# Altium project Shining Pig.PrjPCB (part 3 of 3)
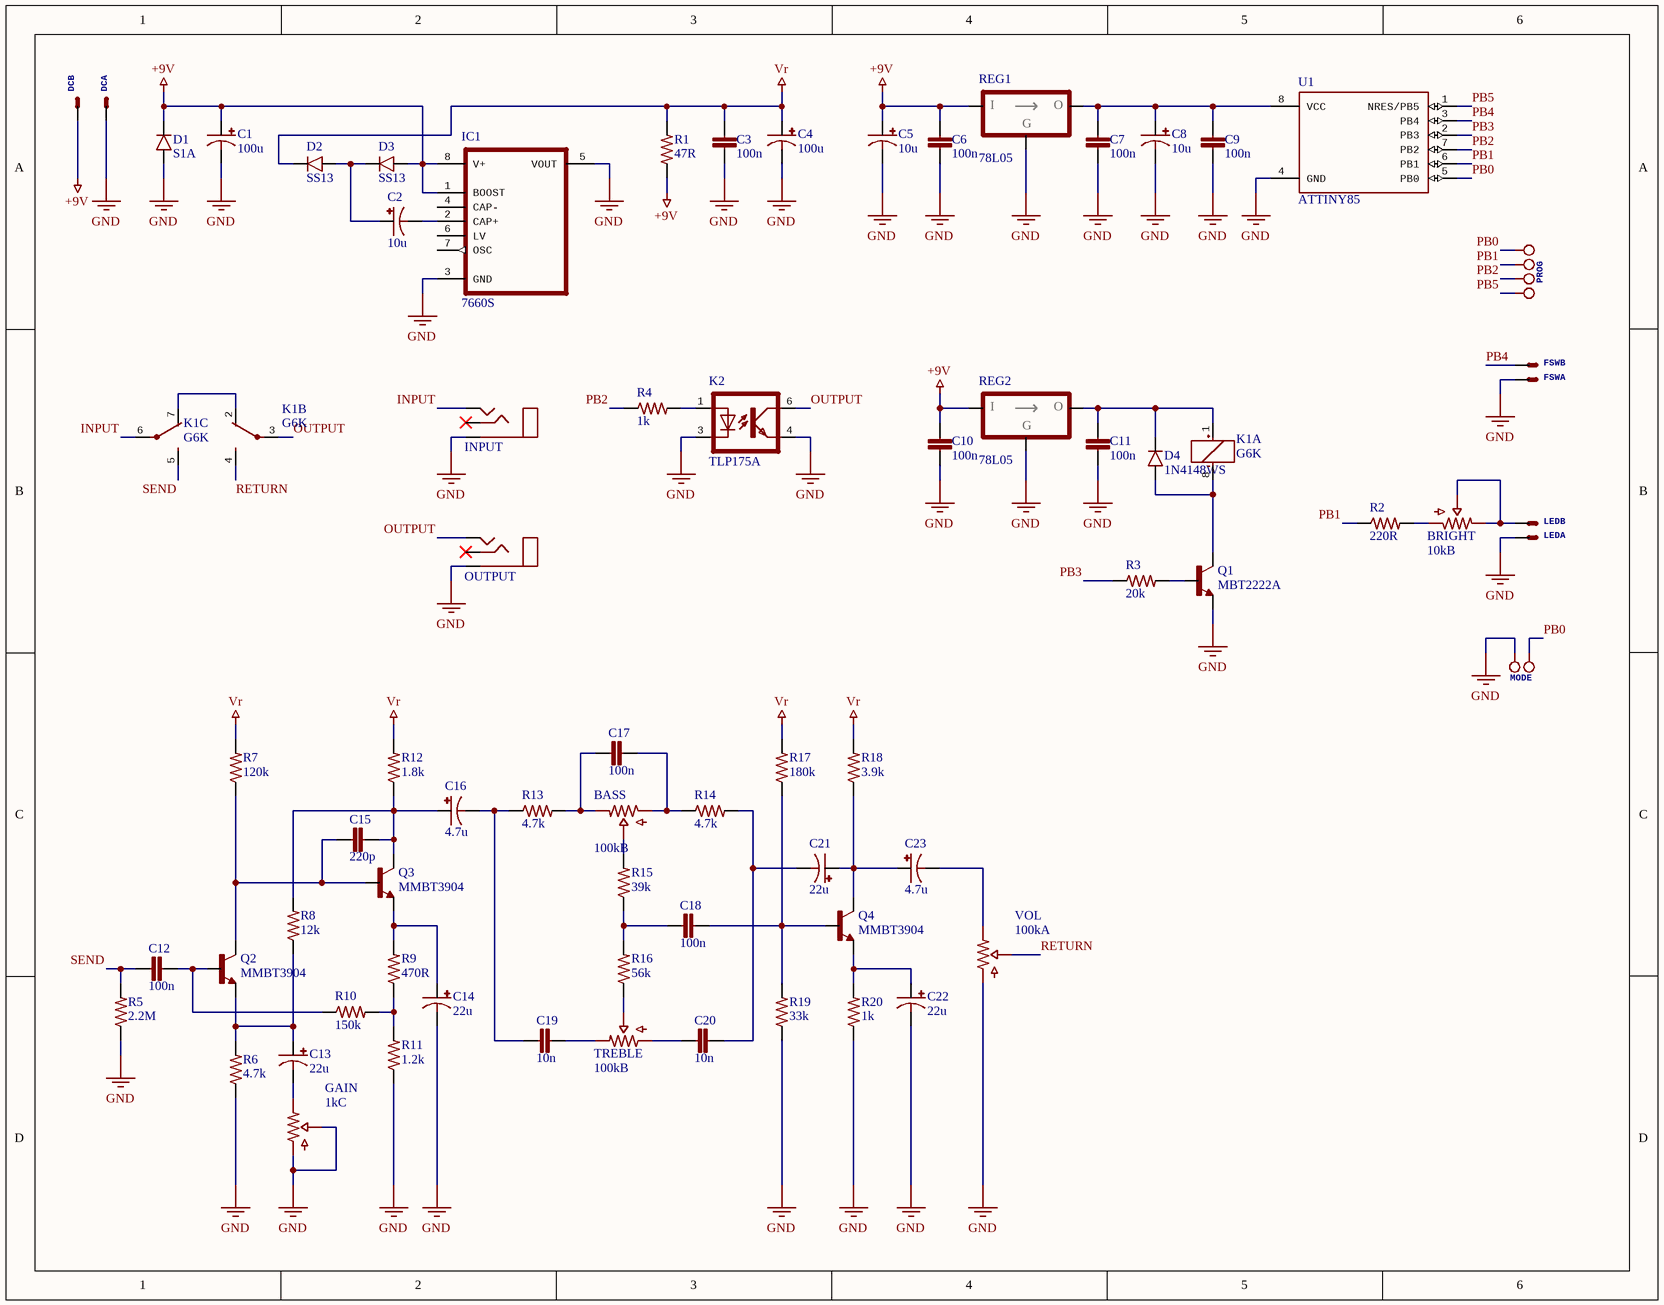
[diagram p2: Shining Pig.SchDoc]

## Sheet Shining Pig.SchDoc (continued)

### Library data of the parts (continued)
R7 = CRCW1206120KFKEA: RES SMD 120K OHM 1% 1/4W 1206; Manufacturer: Vishay; Resistance: 120kR; Power Rating: 250mW; Temperature Coefficient: 100ppm/°C; Voltage Rating: 200V; Supplier 1: Farnell; Supplier Part Number 1: 2139596; Manufacturer Part Number: CRCW1206120KFKEA; Stock: 30156; Pricing: 10=0.0415, 100=0.0276, 500=0.0231, 1000=0.0126, 2500=0.0116 (EUR); RoHS: Yes; Case/Package: 1206; Weight: 0.000353oz; Contact Plating: Tin; Case Code (Imperial): 1206; Case Code (Metric): 3216; Min Operating Temperature: -55°C; Max Operating Temperature: 155°C; Tolerance: 1%; Composition: Thick Film; Packaging: Tape and Reel; Military Standard: Not; Package Quantity: 10; Number of Terminations: 2; Termination: SMD/SMT; Max Power Dissipation: 250mW; Voltage Rating (DC): 200V; Features: Automotive AEC-Q200; Length: 3.2mm; Height: 0.55mm; Depth: 1.6mm; Width: 1.6mm; Radiation Hardening: No; Lead Free: Lead Free; REACH SVHC: Unknown; ComponentLink1URL: https://datasheet.ciiva.com/11808/0900766b80d98b5e-11808652.pdf?src-supplier=RSComponents; ComponentLink1Description: https://datasheet.ciiva.com/11808/0900766b80d98b5e-11808652.pdf?src-supplier=RSComponents; ComponentLink2URL: https://datasheet.ciiva.com/7714/1697337-7714312.pdf?src-supplier=Element14; ComponentLink2Description: https://datasheet.ciiva.com/7714/1697337-7714312.pdf?src-supplier=Element14; ComponentLink3URL: https://datasheet.ciiva.com/7714/1697337-7714313.pdf?src-supplier=Element14; ComponentLink3Description: https://datasheet.ciiva.com/7714/1697337-7714313.pdf?src-supplier=Element14; ComponentLink4URL: https://datasheet.ciiva.com/22708/1697337-22708105.pdf?src-supplier=Element14; ComponentLink4Description: https://datasheet.ciiva.com/22708/1697337-22708105.pdf?src-supplier=Element14; ComponentLink5URL: https://datasheet.ciiva.com/22675/1847332-22675915.pdf?src-supplier=Element14; ComponentLink5Description: https://datasheet.ciiva.com/22675/1847332-22675915.pdf?src-supplier=Element14; ComponentLink6URL: https://datasheet.ciiva.com/2469/dcrcwe3-2469512.pdf?src-supplier=Digi-Key; ComponentLink6Description: https://datasheet.ciiva.com/2469/dcrcwe3-2469512.pdf?src-supplier=Digi-Key; ComponentLink7URL: https://datasheet.ciiva.com/2469/dcrcwe3-2469510.pdf?src-supplier=Digi-Key; ComponentLink7Description: https://datasheet.ciiva.com/2469/dcrcwe3-2469510.pdf?src-supplier=Digi-Key; ComponentLink8URL: https://datasheet.ciiva.com/2469/dcrcwe3-2469511.pdf?src-supplier=Digi-Key; ComponentLink8Description: https://datasheet.ciiva.com/2469/dcrcwe3-2469511.pdf?src-supplier=Digi-Key; ComponentLink9URL: https://datasheet.ciiva.com/26316/fld-crcw-e3-data-en-26316475.pdf?src-supplier=Distrelec; ComponentLink9Description: https://datasheet.ciiva.com/26316/fld-crcw-e3-data-en-26316475.pdf?src-supplier=Distrelec; ComponentLink10URL: https://datasheet.ciiva.com/7800/125364-7800558.pdf?src-supplier=Element14; ComponentLink10Description: https://datasheet.ciiva.com/7800/125364-7800558.pdf?src-supplier=Element14; Price: 0.028
R8 = CRCW060312K0FKEA: RES SMD 12K OHM 1% 1/10W 0603; Manufacturer: Vishay; Resistance: 12kR; Temperature Coefficient: 100ppm/°C; Power Rating: 100mW; Voltage Rating: 75V; Supplier 1: Farnell; Supplier Part Number 1: 1652834; Manufacturer Part Number: CRCW060312K0FKEA; Stock: 58266; Pricing: 10=0.0169, 100=0.013, 500=0.0113, 1000=0.0068 (EUR); RoHS: Yes; Mount: Surface Mount; Case/Package: 0603; Weight: 7.1E-05oz; Contact Plating: Tin; Case Code (Metric): 1608; Case Code (Imperial): 0603; Min Operating Temperature: -55°C; Max Operating Temperature: 155°C; Tolerance: 1%; Composition: Thick Film; Package Quantity: 10; Packaging: Tape and Reel; Number of Terminations: 2; Termination: SMD/SMT; Military Standard: Not; Max Power Dissipation: 100mW; Voltage Rating (DC): 75V; Features: Automotive AEC-Q200; Length: 1.55mm; Height: 0.45mm; Width: 0.033inch; Depth: 0.85mm; Radiation Hardening: No; REACH SVHC: Unknown; Lead Free: Lead Free; ComponentLink1URL: https://datasheet.ciiva.com/11811/0900766b80d98afc-11811312.pdf?src-supplier=RSComponents; ComponentLink1Description: https://datasheet.ciiva.com/11811/0900766b80d98afc-11811312.pdf?src-supplier=RSComponents; ComponentLink2URL: https://datasheet.ciiva.com/2466/dcrcwe3-2466560.pdf?src-supplier=Digi-Key; ComponentLink2Description: https://datasheet.ciiva.com/2466/dcrcwe3-2466560.pdf?src-supplier=Digi-Key; ComponentLink3URL: https://datasheet.ciiva.com/2466/dcrcwe3-2466561.pdf?src-supplier=Digi-Key; ComponentLink3Description: https://datasheet.ciiva.com/2466/dcrcwe3-2466561.pdf?src-supplier=Digi-Key; ComponentLink4URL: https://datasheet.ciiva.com/2466/dcrcwe3-2466562.pdf?src-supplier=Digi-Key; ComponentLink4Description: https://datasheet.ciiva.com/2466/dcrcwe3-2466562.pdf?src-supplier=Digi-Key; ComponentLink5URL: https://datasheet.ciiva.com/16430/dcrcwe3-16430069.pdf?src-supplier=Future+Electronics; ComponentLink5Description: https://datasheet.ciiva.com/16430/dcrcwe3-16430069.pdf?src-supplier=Future+Electronics; ComponentLink6URL: https://datasheet.ciiva.com/16515/dcrcwe3-16515029.pdf?src-supplier=Avnet+Asia; ComponentLink6Description: https://datasheet.ciiva.com/16515/dcrcwe3-16515029.pdf?src-supplier=Avnet+Asia; ComponentLink7URL: https://datasheet.ciiva.com/3256/dcrcwe3-3256998.pdf?src-supplier=Avnet; ComponentLink7Description: https://datasheet.ciiva.com/3256/dcrcwe3-3256998.pdf?src-supplier=Avnet; ComponentLink8URL: https://datasheet.ciiva.com/5545/dcrcwe3-109170-5545254.pdf?src-supplier=Mouser; ComponentLink8Description: https://datasheet.ciiva.com/5545/dcrcwe3-109170-5545254.pdf?src-supplier=Mouser; ComponentLink9URL: https://datasheet.ciiva.com/3256/dcrcwe3-3256999.pdf?src-supplier=Avnet; ComponentLink9Description: https://datasheet.ciiva.com/3256/dcrcwe3-3256999.pdf?src-supplier=Avnet; ComponentLink10URL: https://datasheet.ciiva.com/7841/1533075-7841820.pdf?src-supplier=Element14; ComponentLink10Description: https://datasheet.ciiva.com/7841/1533075-7841820.pdf?src-supplier=Element14; ComponentLink11URL: https://datasheet.ciiva.com/16885/dcrcwe3-16885263.pdf?src-supplier=Avnet+Europe; ComponentLink11Description: https://datasheet.ciiva.com/16885/dcrcwe3-16885263.pdf?src-supplier=Avnet+Europe; Price: 0.0074
R9 = CRCW0603470RFKEA: RES SMD 470 OHM 1% 1/10W 0603; Manufacturer: Vishay; Temperature Coefficient: 100ppm/°C; Power Rating: 100mW; Voltage Rating: 75V; Supplier 1: Farnell; Supplier Part Number 1: 1469815; Manufacturer Part Number: CRCW0603470RFKEA; Stock: 171327; Pricing: 10=0.017, 100=0.0131, 500=0.0114, 1000=0.008 (EUR); RoHS: Yes; Mount: Surface Mount; Case/Package: 0603; Weight: 7.1E-05oz; Contact Plating: Tin; Case Code (Metric): 1608; Case Code (Imperial): 0603; Min Operating Temperature: -55°C; Max Operating Temperature: 155°C; Resistance: 470R; Tolerance: 1%; Composition: Thick Film; Package Quantity: 10; Packaging: Tape and Reel; Number of Terminations: 2; Termination: SMD/SMT; Military Standard: Not; Max Power Dissipation: 100mW; Voltage Rating (DC): 75V; Features: Automotive AEC-Q200; Length: 1.55mm; Height: 0.45mm; Width: 0.033inch; Depth: 0.85mm; Radiation Hardening: No; Lead Free: Lead Free; REACH SVHC: Unknown; ComponentLink1URL: https://datasheet.ciiva.com/11808/0900766b80d98afc-11808677.pdf?src-supplier=RSComponents; ComponentLink1Description: https://datasheet.ciiva.com/11808/0900766b80d98afc-11808677.pdf?src-supplier=RSComponents; ComponentLink2URL: https://datasheet.ciiva.com/2465/dcrcwe3-2465555.pdf?src-supplier=Digi-Key; ComponentLink2Description: https://datasheet.ciiva.com/2465/dcrcwe3-2465555.pdf?src-supplier=Digi-Key; ComponentLink3URL: https://datasheet.ciiva.com/5551/dcrcwe3-109170-5551784.pdf?src-supplier=Mouser; ComponentLink3Description: https://datasheet.ciiva.com/5551/dcrcwe3-109170-5551784.pdf?src-supplier=Mouser; ComponentLink4URL: https://datasheet.ciiva.com/7777/1720486-7777560.pdf?src-supplier=Element14; ComponentLink4Description: https://datasheet.ciiva.com/7777/1720486-7777560.pdf?src-supplier=Element14; ComponentLink5URL: https://datasheet.ciiva.com/7777/1720486-7777561.pdf?src-supplier=Element14; ComponentLink5Description: https://datasheet.ciiva.com/7777/1720486-7777561.pdf?src-supplier=Element14; ComponentLink6URL: https://datasheet.ciiva.com/26316/fld-crcw-e3-data-en-26316542.pdf?src-supplier=Distrelec; ComponentLink6Description: https://datasheet.ciiva.com/26316/fld-crcw-e3-data-en-26316542.pdf?src-supplier=Distrelec; ComponentLink7URL: https://datasheet.ciiva.com/2465/dcrcwe3-2465556.pdf?src-supplier=Digi-Key; ComponentLink7Description: https://datasheet.ciiva.com/2465/dcrcwe3-2465556.pdf?src-supplier=Digi-Key; ComponentLink8URL: https://datasheet.ciiva.com/2465/dcrcwe3-2465557.pdf?src-supplier=Digi-Key; ComponentLink8Description: https://datasheet.ciiva.com/2465/dcrcwe3-2465557.pdf?src-supplier=Digi-Key; ComponentLink9URL: https://datasheet.ciiva.com/15159/getdatasheetpartid-45798-15159558.pdf?src-supplier=Verical; ComponentLink9Description: https://datasheet.ciiva.com/15159/getdatasheetpartid-45798-15159558.pdf?src-supplier=Verical; ComponentLink10URL: https://datasheet.ciiva.com/16893/dcrcw-16893414.pdf?src-supplier=Avnet+Europe; ComponentLink10Description: https://datasheet.ciiva.com/16893/dcrcw-16893414.pdf?src-supplier=Avnet+Europe; ComponentLink11URL: https://datasheet.ciiva.com/3257/dcrcwe3-3257623.pdf?src-supplier=Avnet; ComponentLink11Description: https://datasheet.ciiva.com/3257/dcrcwe3-3257623.pdf?src-supplier=Avnet; ComponentLink12URL: https://datasheet.ciiva.com/3257/dcrcwe3-3257624.pdf?src-supplier=Avnet; ComponentLink12Description: https://datasheet.ciiva.com/3257/dcrcwe3-3257624.pdf?src-supplier=Avnet; ComponentLink13URL: https://datasheet.ciiva.com/7777/1697337-7777322.pdf?src-supplier=Element14; ComponentLink13Description: https://datasheet.ciiva.com/7777/1697337-7777322.pdf?src-supplier=Element14; Price: 0.0129
R10 = CRCW0603150KFKEA: RES SMD 150K OHM 1% 1/10W 0603; Manufacturer: Vishay; Resistance: 150kR; Temperature Coefficient: 100ppm/°C; Power Rating: 100mW; Voltage Rating: 75V; Supplier 1: Farnell; Supplier Part Number 1: 1469759; Manufacturer Part Number: CRCW0603150KFKEA; Stock: 76499; Pricing: 10=0.0112, 100=0.0092, 500=0.0084, 1000=0.0075 (EUR); RoHS: Yes; Mount: Surface Mount; Case/Package: 0603; Weight: 7.1E-05oz; Contact Plating: Tin; Case Code (Imperial): 0603; Case Code (Metric): 1608; Min Operating Temperature: -55°C; Max Operating Temperature: 155°C; Composition: Thick Film; Tolerance: 1%; Packaging: Tape and Reel; Package Quantity: 5000; Military Standard: Not; Termination: SMD/SMT; Voltage Rating (DC): 75V; Length: 1.55mm; Height: 0.45mm; Width: 0.85mm; Depth: 0.85mm; Lead Free: Lead Free; REACH SVHC: Unknown; ComponentLink1URL: https://datasheet.ciiva.com/11809/0900766b80d98afc-11809072.pdf?src-supplier=RSComponents; ComponentLink1Description: https://datasheet.ciiva.com/11809/0900766b80d98afc-11809072.pdf?src-supplier=RSComponents; ComponentLink2URL: https://datasheet.ciiva.com/5551/dcrcwe3-109170-5551862.pdf?src-supplier=Mouser; ComponentLink2Description: https://datasheet.ciiva.com/5551/dcrcwe3-109170-5551862.pdf?src-supplier=Mouser; ComponentLink3URL: https://datasheet.ciiva.com/3257/dcrcwe3-3257048.pdf?src-supplier=Avnet; ComponentLink3Description: https://datasheet.ciiva.com/3257/dcrcwe3-3257048.pdf?src-supplier=Avnet; ComponentLink4URL: https://datasheet.ciiva.com/7673/1697337-7673288.pdf?src-supplier=Element14; ComponentLink4Description: https://datasheet.ciiva.com/7673/1697337-7673288.pdf?src-supplier=Element14; ComponentLink5URL: https://datasheet.ciiva.com/3257/dcrcwe3-3257049.pdf?src-supplier=Avnet; ComponentLink5Description: https://datasheet.ciiva.com/3257/dcrcwe3-3257049.pdf?src-supplier=Avnet; ComponentLink6URL: https://datasheet.ciiva.com/16885/dcrcwe3-16885417.pdf?src-supplier=Avnet+Europe; ComponentLink6Description: https://datasheet.ciiva.com/16885/dcrcwe3-16885417.pdf?src-supplier=Avnet+Europe; ComponentLink7URL: https://datasheet.ciiva.com/15159/getdatasheetpartid-37540-15159436.pdf?src-supplier=Verical; ComponentLink7Description: https://datasheet.ciiva.com/15159/getdatasheetpartid-37540-15159436.pdf?src-supplier=Verical; ComponentLink8URL: https://datasheet.ciiva.com/16391/dcrcwe3-16391407.pdf?src-supplier=Future+Electronics; ComponentLink8Description: https://datasheet.ciiva.com/16391/dcrcwe3-16391407.pdf?src-supplier=Future+Electronics; ComponentLink9URL: https://datasheet.ciiva.com/16761/70201119-16761887.pdf?src-supplier=Allied+Electronics; ComponentLink9Description: https://datasheet.ciiva.com/16761/70201119-16761887.pdf?src-supplier=Allied+Electronics; Price: 0.0093
R11 = CRCW06031K20FKEA: RES SMD 1.2K OHM 1% 1/10W 0603; Manufacturer: Vishay; Resistance: 1.2kR; Power Rating: 100mW; Temperature Coefficient: 100ppm/°C; Voltage Rating: 75V; Supplier 1: Farnell; Supplier Part Number 1: 1469741; Manufacturer Part Number: CRCW06031K20FKEA; Stock: 73390; Pricing: 10=0.0169, 100=0.013, 500=0.0113, 1000=0.008 (EUR); RoHS: Yes; Mount: Surface Mount; Case/Package: 0603; Weight: 7.1E-05oz; Contact Plating: Tin; Case Code (Metric): 1608; Case Code (Imperial): 0603; Min Operating Temperature: -55°C; Max Operating Temperature: 155°C; Tolerance: 1%; Packaging: Tape and Reel; Composition: Thick Film; Termination: SMD/SMT; Package Quantity: 10; Number of Terminations: 2; Military Standard: Not; Max Power Dissipation: 100mW; Voltage Rating (DC): 75V; Features: Automotive AEC-Q200; Length: 1.55mm; Height: 0.45mm; Width: 0.033inch; Depth: 0.85mm; Radiation Hardening: No; Lead Free: Lead Free; REACH SVHC: Unknown; ComponentLink1URL: https://datasheet.ciiva.com/11811/0900766b80d98afc-11811521.pdf?src-supplier=RSComponents; ComponentLink1Description: https://datasheet.ciiva.com/11811/0900766b80d98afc-11811521.pdf?src-supplier=RSComponents; ComponentLink2URL: https://datasheet.ciiva.com/26316/fld-crcw-e3-data-en-26316553.pdf?src-supplier=Distrelec; ComponentLink2Description: https://datasheet.ciiva.com/26316/fld-crcw-e3-data-en-26316553.pdf?src-supplier=Distrelec; ComponentLink3URL: https://datasheet.ciiva.com/5562/dcrcwe3-109170-5562444.pdf?src-supplier=Mouser; ComponentLink3Description: https://datasheet.ciiva.com/5562/dcrcwe3-109170-5562444.pdf?src-supplier=Mouser; ComponentLink4URL: https://datasheet.ciiva.com/7777/1697337-7777549.pdf?src-supplier=Element14; ComponentLink4Description: https://datasheet.ciiva.com/7777/1697337-7777549.pdf?src-supplier=Element14; ComponentLink5URL: https://datasheet.ciiva.com/2466/dcrcwe3-2466208.pdf?src-supplier=Digi-Key; ComponentLink5Description: https://datasheet.ciiva.com/2466/dcrcwe3-2466208.pdf?src-supplier=Digi-Key; ComponentLink6URL: https://datasheet.ciiva.com/16778/70201119-16778936.pdf?src-supplier=Allied+Electronics; ComponentLink6Description: https://datasheet.ciiva.com/16778/70201119-16778936.pdf?src-supplier=Allied+Electronics; ComponentLink7URL: https://datasheet.ciiva.com/22871/70201119-22871945.pdf?src-supplier=Allied+Electronics; ComponentLink7Description: https://datasheet.ciiva.com/22871/70201119-22871945.pdf?src-supplier=Allied+Electronics; ComponentLink8URL: https://datasheet.ciiva.com/7777/1697337-7777291.pdf?src-supplier=Element14; ComponentLink8Description: https://datasheet.ciiva.com/7777/1697337-7777291.pdf?src-supplier=Element14; ComponentLink9URL: https://datasheet.ciiva.com/2466/dcrcwe3-2466206.pdf?src-supplier=Digi-Key; ComponentLink9Description: https://datasheet.ciiva.com/2466/dcrcwe3-2466206.pdf?src-supplier=Digi-Key; ComponentLink10URL: https://datasheet.ciiva.com/2466/dcrcwe3-2466207.pdf?src-supplier=Digi-Key; ComponentLink10Description: https://datasheet.ciiva.com/2466/dcrcwe3-2466207.pdf?src-supplier=Digi-Key; Price: 0.0128
R12 = CRCW12061K80FKEA: RES SMD 1.8K OHM 1% 1/4W 1206; Manufacturer: Vishay; Resistance: 1.8kR; Temperature Coefficient: 100ppm/°C; Power Rating: 250mW; Voltage Rating: 200V; Supplier 1: Farnell; Supplier Part Number 1: 2139458; Manufacturer Part Number: CRCW12061K80FKEA; Stock: 21216; Pricing: 10=0.0415, 100=0.0276, 500=0.023, 1000=0.0135, 2500=0.0116 (EUR); RoHS: Yes; Case/Package: 1206; Weight: 0.000353oz; Contact Plating: Tin; Case Code (Metric): 3216; Case Code (Imperial): 1206; Min Operating Temperature: -55°C; Max Operating Temperature: 155°C; Composition: Thick Film; Tolerance: 1%; Packaging: Tape and Reel; Number of Terminations: 2; Military Standard: Not; Termination: SMD/SMT; Max Power Dissipation: 250mW; Voltage Rating (DC): 200V; Features: Automotive AEC-Q200; Package Quantity: 10; Length: 3.2mm; Height: 0.55mm; Width: 0.063inch; Depth: 1.6mm; Radiation Hardening: No; REACH SVHC: Unknown; Lead Free: Lead Free; ComponentLink1URL: https://datasheet.ciiva.com/11811/0900766b80d98b5e-11811553.pdf?src-supplier=RSComponents; ComponentLink1Description: https://datasheet.ciiva.com/11811/0900766b80d98b5e-11811553.pdf?src-supplier=RSComponents; ComponentLink2URL: https://datasheet.ciiva.com/2515/dcrcwe3-2515619.pdf?src-supplier=Digi-Key; ComponentLink2Description: https://datasheet.ciiva.com/2515/dcrcwe3-2515619.pdf?src-supplier=Digi-Key; ComponentLink3URL: https://datasheet.ciiva.com/2515/dcrcwe3-2515620.pdf?src-supplier=Digi-Key; ComponentLink3Description: https://datasheet.ciiva.com/2515/dcrcwe3-2515620.pdf?src-supplier=Digi-Key; ComponentLink4URL: https://datasheet.ciiva.com/2515/dcrcwe3-2515621.pdf?src-supplier=Digi-Key; ComponentLink4Description: https://datasheet.ciiva.com/2515/dcrcwe3-2515621.pdf?src-supplier=Digi-Key; ComponentLink5URL: https://datasheet.ciiva.com/5550/dcrcwe3-109170-5550215.pdf?src-supplier=Mouser; ComponentLink5Description: https://datasheet.ciiva.com/5550/dcrcwe3-109170-5550215.pdf?src-supplier=Mouser; ComponentLink6URL: https://datasheet.ciiva.com/17203/dcrcwe3-17203511.pdf?src-supplier=Avnet+Europe; ComponentLink6Description: https://datasheet.ciiva.com/17203/dcrcwe3-17203511.pdf?src-supplier=Avnet+Europe; ComponentLink7URL: https://datasheet.ciiva.com/22704/1697337-22704456.pdf?src-supplier=Element14; ComponentLink7Description: https://datasheet.ciiva.com/22704/1697337-22704456.pdf?src-supplier=Element14; ComponentLink8URL: https://datasheet.ciiva.com/9096/dcrcwe3-9096428.pdf?src-supplier=Avnet; ComponentLink8Description: https://datasheet.ciiva.com/9096/dcrcwe3-9096428.pdf?src-supplier=Avnet; ComponentLink9URL: https://datasheet.ciiva.com/7673/1697337-7673053.pdf?src-supplier=Element14; ComponentLink9Description: https://datasheet.ciiva.com/7673/1697337-7673053.pdf?src-supplier=Element14; ComponentLink10URL: https://datasheet.ciiva.com/7800/125364-7800621.pdf?src-supplier=Element14; ComponentLink10Description: https://datasheet.ciiva.com/7800/125364-7800621.pdf?src-supplier=Element14; ComponentLink11URL: https://datasheet.ciiva.com/7673/1697337-7673054.pdf?src-supplier=Element14; ComponentLink11Description: https://datasheet.ciiva.com/7673/1697337-7673054.pdf?src-supplier=Element14; ComponentLink12URL: https://datasheet.ciiva.com/16763/70201119-16763566.pdf?src-supplier=Allied+Electronics; ComponentLink12Description: https://datasheet.ciiva.com/16763/70201119-16763566.pdf?src-supplier=Allied+Electronics; ComponentLink13URL: https://datasheet.ciiva.com/16498/dcrcwe3-16498255.pdf?src-supplier=Future+Electronics; ComponentLink13Description: https://datasheet.ciiva.com/16498/dcrcwe3-16498255.pdf?src-supplier=Future+Electronics; Price: 0.0273
R15 = CRCW060339K0FKEA: RES SMD 39K OHM 1% 1/10W 0603; Manufacturer: Vishay; Resistance: 39kR; Power Rating: 100mW; Temperature Coefficient: 100ppm/°C; Voltage Rating: 75V; Supplier 1: Farnell; Supplier Part Number 1: 1469804; Manufacturer Part Number: CRCW060339K0FKEA; Stock: 76312; Pricing: 10=0.0112, 100=0.0092, 500=0.0084, 1000=0.0075 (EUR); RoHS: Yes; Mount: Surface Mount; Case/Package: 0603; Number of Pins: 2; Weight: 7.1E-05oz; Contact Plating: Tin; Case Code (Metric): 1608; Case Code (Imperial): 0603; Min Operating Temperature: -55°C; Max Operating Temperature: 155°C; Tolerance: 1%; Packaging: Tape and Reel; Composition: Thick Film; Termination: SMD/SMT; Package Quantity: 10; Number of Terminations: 2; Military Standard: Not; Max Power Dissipation: 100mW; Voltage Rating (DC): 75V; Features: Automotive AEC-Q200; Length: 1.55mm; Height: 0.45mm; Width: 0.033inch; Depth: 0.85mm; Radiation Hardening: No; REACH SVHC: Unknown; Lead Free: Lead Free; ComponentLink1URL: https://datasheet.ciiva.com/11810/0900766b80d98afc-11810034.pdf?src-supplier=RSComponents; ComponentLink1Description: https://datasheet.ciiva.com/11810/0900766b80d98afc-11810034.pdf?src-supplier=RSComponents; ComponentLink2URL: https://datasheet.ciiva.com/16436/dcrcwe3-16436039.pdf?src-supplier=Future+Electronics; ComponentLink2Description: https://datasheet.ciiva.com/16436/dcrcwe3-16436039.pdf?src-supplier=Future+Electronics; ComponentLink3URL: https://datasheet.ciiva.com/2465/dcrcwe3-2465918.pdf?src-supplier=Digi-Key; ComponentLink3Description: https://datasheet.ciiva.com/2465/dcrcwe3-2465918.pdf?src-supplier=Digi-Key; ComponentLink4URL: https://datasheet.ciiva.com/3257/dcrcwe3-3257518.pdf?src-supplier=Avnet; ComponentLink4Description: https://datasheet.ciiva.com/3257/dcrcwe3-3257518.pdf?src-supplier=Avnet; ComponentLink5URL: https://datasheet.ciiva.com/2465/dcrcwe3-2465920.pdf?src-supplier=Digi-Key; ComponentLink5Description: https://datasheet.ciiva.com/2465/dcrcwe3-2465920.pdf?src-supplier=Digi-Key; ComponentLink6URL: https://datasheet.ciiva.com/7841/1697337-7841830.pdf?src-supplier=Element14; ComponentLink6Description: https://datasheet.ciiva.com/7841/1697337-7841830.pdf?src-supplier=Element14; ComponentLink7URL: https://datasheet.ciiva.com/16514/dcrcwe3-16514791.pdf?src-supplier=Avnet+Asia; ComponentLink7Description: https://datasheet.ciiva.com/16514/dcrcwe3-16514791.pdf?src-supplier=Avnet+Asia; ComponentLink8URL: https://datasheet.ciiva.com/16768/70201119-16768839.pdf?src-supplier=Allied+Electronics; ComponentLink8Description: https://datasheet.ciiva.com/16768/70201119-16768839.pdf?src-supplier=Allied+Electronics; ComponentLink9URL: https://datasheet.ciiva.com/7841/1697337-7841593.pdf?src-supplier=Element14; ComponentLink9Description: https://datasheet.ciiva.com/7841/1697337-7841593.pdf?src-supplier=Element14; ComponentLink10URL: https://datasheet.ciiva.com/3257/dcrcwe3-3257519.pdf?src-supplier=Avnet; ComponentLink10Description: https://datasheet.ciiva.com/3257/dcrcwe3-3257519.pdf?src-supplier=Avnet; ComponentLink11URL: https://datasheet.ciiva.com/26316/fld-crcw-e3-data-en-26316550.pdf?src-supplier=Distrelec; ComponentLink11Description: https://datasheet.ciiva.com/26316/fld-crcw-e3-data-en-26316550.pdf?src-supplier=Distrelec; ComponentLink12URL: https://datasheet.ciiva.com/2465/dcrcwe3-2465919.pdf?src-supplier=Digi-Key; ComponentLink12Description: https://datasheet.ciiva.com/2465/dcrcwe3-2465919.pdf?src-supplier=Digi-Key; ComponentLink13URL: https://datasheet.ciiva.com/5551/dcrcwe3-109170-5551951.pdf?src-supplier=Mouser; ComponentLink13Description: https://datasheet.ciiva.com/5551/dcrcwe3-109170-5551951.pdf?src-supplier=Mouser; Price: 0.0093
R16 = CRCW06035K60FKEA: RES SMD 5.6K OHM 1% 1/10W 0603; Manufacturer: Vishay; Resistance: 5.6kR; Temperature Coefficient: 100ppm/°C; Power Rating: 100mW; Voltage Rating: 75V; Supplier 1: Farnell; Supplier Part Number 1: 1469820; Manufacturer Part Number: CRCW06035K60FKEA; Stock: 87511; Pricing: 10=0.0112, 100=0.0092, 500=0.0084, 1000=0.0061 (EUR); RoHS: Yes; Mount: Surface Mount; Case/Package: 0603; Number of Pins: 2; Weight: 7.1E-05oz; Contact Plating: Tin; Case Code (Imperial): 0603; Case Code (Metric): 1608; Min Operating Temperature: -55°C; Max Operating Temperature: 155°C; Tolerance: 1%; Composition: Thick Film; Packaging: Tape and Reel; Package Quantity: 5000; Termination: SMD/SMT; Voltage Rating (DC): 75V; Number of Terminations: 2; Military Standard: Not; Working Voltage: 75V; Length: 1.55mm; Height: 0.45mm; Width: 0.85mm; Depth: 0.85mm; Radiation Hardening: No; REACH SVHC: Unknown; Lead Free: Lead Free; ComponentLink1URL: https://datasheet.ciiva.com/3883/41405319s7915995n6892-3883091.pdf?src-supplier=Arrow; ComponentLink1Description: https://datasheet.ciiva.com/3883/41405319s7915995n6892-3883091.pdf?src-supplier=Arrow; ComponentLink2URL: https://datasheet.ciiva.com/11809/0900766b80d98afc-11809147.pdf?src-supplier=RSComponents; ComponentLink2Description: https://datasheet.ciiva.com/11809/0900766b80d98afc-11809147.pdf?src-supplier=RSComponents; ComponentLink3URL: https://datasheet.ciiva.com/26314/fld-crcw-e3-data-en-26314743.pdf?src-supplier=Distrelec; ComponentLink3Description: https://datasheet.ciiva.com/26314/fld-crcw-e3-data-en-26314743.pdf?src-supplier=Distrelec; ComponentLink4URL: https://datasheet.ciiva.com/16786/70201119-16786959.pdf?src-supplier=Allied+Electronics; ComponentLink4Description: https://datasheet.ciiva.com/16786/70201119-16786959.pdf?src-supplier=Allied+Electronics; ComponentLink5URL: https://datasheet.ciiva.com/3257/dcrcwe3-3257768.pdf?src-supplier=Avnet; ComponentLink5Description: https://datasheet.ciiva.com/3257/dcrcwe3-3257768.pdf?src-supplier=Avnet; ComponentLink6URL: https://datasheet.ciiva.com/3257/dcrcwe3-3257769.pdf?src-supplier=Avnet; ComponentLink6Description: https://datasheet.ciiva.com/3257/dcrcwe3-3257769.pdf?src-supplier=Avnet; ComponentLink7URL: https://datasheet.ciiva.com/7841/1697337-7841836.pdf?src-supplier=Element14; ComponentLink7Description: https://datasheet.ciiva.com/7841/1697337-7841836.pdf?src-supplier=Element14; ComponentLink8URL: https://datasheet.ciiva.com/7841/1697337-7841613.pdf?src-supplier=Element14; ComponentLink8Description: https://datasheet.ciiva.com/7841/1697337-7841613.pdf?src-supplier=Element14; Price: 0.0093
R17 = CRCW1206180KFKEA: RES SMD 180K OHM 1% 1/4W 1206; Manufacturer: Vishay; Resistance: 180kR; Temperature Coefficient: 100ppm/°C; Power Rating: 250mW; Voltage Rating: 200V; Supplier 1: Farnell; Supplier Part Number 1: 2139611; Manufacturer Part Number: CRCW1206180KFKEA; Stock: 15809; Pricing: 10=0.0415, 100=0.0276, 500=0.0231, 1000=0.0135, 2500=0.0116 (EUR); RoHS: Yes; Mount: Surface Mount; Case/Package: 1206; Number of Pins: 2; Weight: 0.000353oz; Contact Plating: Tin; Case Code (Imperial): 1206; Case Code (Metric): 3216; Min Operating Temperature: -55°C; Max Operating Temperature: 155°C; Composition: Thick Film; Tolerance: 1%; Packaging: Tape and Reel; Package Quantity: 10; Termination: SMD/SMT; Number of Terminations: 2; Military Standard: Not; Max Power Dissipation: 250mW; Voltage Rating (DC): 200V; Working Voltage: 200V; Features: Automotive AEC-Q200; Length: 3.2mm; Height: 0.55mm; Width: 1.6mm; Depth: 1.6mm; Radiation Hardening: No; Lead Free: Lead Free; REACH SVHC: Unknown; ComponentLink1URL: https://datasheet.ciiva.com/11811/0900766b80d98b5e-11811640.pdf?src-supplier=RSComponents; ComponentLink1Description: https://datasheet.ciiva.com/11811/0900766b80d98b5e-11811640.pdf?src-supplier=RSComponents; ComponentLink2URL: https://datasheet.ciiva.com/2515/dcrcwe3-2515718.pdf?src-supplier=Digi-Key; ComponentLink2Description: https://datasheet.ciiva.com/2515/dcrcwe3-2515718.pdf?src-supplier=Digi-Key; ComponentLink3URL: https://datasheet.ciiva.com/2515/dcrcwe3-2515719.pdf?src-supplier=Digi-Key; ComponentLink3Description: https://datasheet.ciiva.com/2515/dcrcwe3-2515719.pdf?src-supplier=Digi-Key; ComponentLink4URL: https://datasheet.ciiva.com/2515/dcrcwe3-2515720.pdf?src-supplier=Digi-Key; ComponentLink4Description: https://datasheet.ciiva.com/2515/dcrcwe3-2515720.pdf?src-supplier=Digi-Key; ComponentLink5URL: https://datasheet.ciiva.com/7714/1697337-7714344.pdf?src-supplier=Element14; ComponentLink5Description: https://datasheet.ciiva.com/7714/1697337-7714344.pdf?src-supplier=Element14; ComponentLink6URL: https://datasheet.ciiva.com/26316/fld-crcw-e3-data-en-26316477.pdf?src-supplier=Distrelec; ComponentLink6Description: https://datasheet.ciiva.com/26316/fld-crcw-e3-data-en-26316477.pdf?src-supplier=Distrelec; ComponentLink7URL: https://datasheet.ciiva.com/8964/dcrcwe3-8964238.pdf?src-supplier=Avnet; ComponentLink7Description: https://datasheet.ciiva.com/8964/dcrcwe3-8964238.pdf?src-supplier=Avnet; ComponentLink8URL: https://datasheet.ciiva.com/7714/1697337-7714345.pdf?src-supplier=Element14; ComponentLink8Description: https://datasheet.ciiva.com/7714/1697337-7714345.pdf?src-supplier=Element14; ComponentLink9URL: https://datasheet.ciiva.com/22708/1697337-22708109.pdf?src-supplier=Element14; ComponentLink9Description: https://datasheet.ciiva.com/22708/1697337-22708109.pdf?src-supplier=Element14; Price: 0.0283
R18 = CRCW12063K90FKEA: RES SMD 3.9K OHM 1% 1/4W 1206; Manufacturer: Vishay; Resistance: 3.9kR; Temperature Coefficient: 100ppm/°C; Voltage Rating: 200V; Power Rating: 250mW; Supplier 1: Farnell; Supplier Part Number 1: 1653127; Manufacturer Part Number: CRCW12063K90FKEA; Stock: 14947; Pricing: 10=0.0415, 100=0.0276, 500=0.0231, 1000=0.0135, 2500=0.0116 (EUR); RoHS: Yes; Case/Package: 1206; Weight: 0.000353oz; Case Code (Imperial): 1206; Case Code (Metric): 3216; Contact Plating: Tin; Min Operating Temperature: -55°C; Max Operating Temperature: 155°C; Tolerance: 1%; Composition: Thick Film; Packaging: Tape and Reel; Package Quantity: 10; Termination: SMD/SMT; Military Standard: Not; Voltage Rating (DC): 200V; Number of Terminations: 2; Max Power Dissipation: 250mW; Features: Automotive AEC-Q200; Length: 3.2mm; Height: 0.55mm; Width: 1.6mm; Depth: 1.6mm; Radiation Hardening: No; REACH SVHC: Unknown; Lead Free: Lead Free; ComponentLink1URL: https://datasheet.ciiva.com/11809/0900766b80d98b5e-11809588.pdf?src-supplier=RSComponents; ComponentLink1Description: https://datasheet.ciiva.com/11809/0900766b80d98b5e-11809588.pdf?src-supplier=RSComponents; ComponentLink2URL: https://datasheet.ciiva.com/16391/dcrcwe3-16391542.pdf?src-supplier=Future+Electronics; ComponentLink2Description: https://datasheet.ciiva.com/16391/dcrcwe3-16391542.pdf?src-supplier=Future+Electronics; ComponentLink3URL: https://datasheet.ciiva.com/26316/fld-crcw-e3-data-en-26316457.pdf?src-supplier=Distrelec; ComponentLink3Description: https://datasheet.ciiva.com/26316/fld-crcw-e3-data-en-26316457.pdf?src-supplier=Distrelec; ComponentLink4URL: https://datasheet.ciiva.com/2497/dcrcwe3-2497228.pdf?src-supplier=Digi-Key; ComponentLink4Description: https://datasheet.ciiva.com/2497/dcrcwe3-2497228.pdf?src-supplier=Digi-Key; ComponentLink5URL: https://datasheet.ciiva.com/16894/dcrcwe3-16894631.pdf?src-supplier=Avnet+Europe; ComponentLink5Description: https://datasheet.ciiva.com/16894/dcrcwe3-16894631.pdf?src-supplier=Avnet+Europe; ComponentLink6URL: https://datasheet.ciiva.com/22674/1847332-22674727.pdf?src-supplier=Element14; ComponentLink6Description: https://datasheet.ciiva.com/22674/1847332-22674727.pdf?src-supplier=Element14; ComponentLink7URL: https://datasheet.ciiva.com/7841/1697337-7841753.pdf?src-supplier=Element14; ComponentLink7Description: https://datasheet.ciiva.com/7841/1697337-7841753.pdf?src-supplier=Element14; ComponentLink8URL: https://datasheet.ciiva.com/5552/dcrcwe3-109170-5552411.pdf?src-supplier=Mouser; ComponentLink8Description: https://datasheet.ciiva.com/5552/dcrcwe3-109170-5552411.pdf?src-supplier=Mouser; ComponentLink9URL: https://datasheet.ciiva.com/2497/dcrcwe3-2497229.pdf?src-supplier=Digi-Key; ComponentLink9Description: https://datasheet.ciiva.com/2497/dcrcwe3-2497229.pdf?src-supplier=Digi-Key; ComponentLink10URL: https://datasheet.ciiva.com/2497/dcrcwe3-2497230.pdf?src-supplier=Digi-Key; ComponentLink10Description: https://datasheet.ciiva.com/2497/dcrcwe3-2497230.pdf?src-supplier=Digi-Key; Price: 0.0168
R19 = CRCW060333K0FKEA: RES SMD 33K OHM 1% 1/10W 0603; Manufacturer: Vishay; Resistance: 33kR; Temperature Coefficient: 100ppm/°C; Power Rating: 100mW; Voltage Rating: 75V; Supplier 1: Farnell; Supplier Part Number 1: 1469801; Manufacturer Part Number: CRCW060333K0FKEA; Stock: 69037; Pricing: 10=0.0112, 100=0.0092, 500=0.0084, 1000=0.0075 (EUR); RoHS: Yes; Mount: Surface Mount; Case/Package: 0603; Weight: 7.1E-05oz; Contact Plating: Tin; Case Code (Metric): 1608; Case Code (Imperial): 0603; Min Operating Temperature: -55°C; Max Operating Temperature: 155°C; Composition: Thick Film; Tolerance: 1%; Package Quantity: 10; Packaging: Tape and Reel; Number of Terminations: 2; Military Standard: Not; Termination: SMD/SMT; Max Power Dissipation: 100mW; Voltage Rating (DC): 75V; Features: Automotive AEC-Q200; Length: 1.55mm; Height: 0.45mm; Width: 0.033inch; Depth: 0.85mm; Radiation Hardening: No; REACH SVHC: Unknown; Lead Free: Lead Free; ComponentLink1URL: https://datasheet.ciiva.com/11809/0900766b80d98afc-11809071.pdf?src-supplier=RSComponents; ComponentLink1Description: https://datasheet.ciiva.com/11809/0900766b80d98afc-11809071.pdf?src-supplier=RSComponents; ComponentLink2URL: https://datasheet.ciiva.com/5547/dcrcwe3-109170-5547006.pdf?src-supplier=Mouser; ComponentLink2Description: https://datasheet.ciiva.com/5547/dcrcwe3-109170-5547006.pdf?src-supplier=Mouser; ComponentLink3URL: https://datasheet.ciiva.com/2525/dcrcwe3-2525247.pdf?src-supplier=Digi-Key; ComponentLink3Description: https://datasheet.ciiva.com/2525/dcrcwe3-2525247.pdf?src-supplier=Digi-Key; ComponentLink4URL: https://datasheet.ciiva.com/7841/1697337-7841829.pdf?src-supplier=Element14; ComponentLink4Description: https://datasheet.ciiva.com/7841/1697337-7841829.pdf?src-supplier=Element14; ComponentLink5URL: https://datasheet.ciiva.com/16884/dcrcwe3-16884901.pdf?src-supplier=Avnet+Europe; ComponentLink5Description: https://datasheet.ciiva.com/16884/dcrcwe3-16884901.pdf?src-supplier=Avnet+Europe; ComponentLink6URL: https://datasheet.ciiva.com/16777/70201119-16777127.pdf?src-supplier=Allied+Electronics; ComponentLink6Description: https://datasheet.ciiva.com/16777/70201119-16777127.pdf?src-supplier=Allied+Electronics; ComponentLink7URL: https://datasheet.ciiva.com/17045/dcrcwe3-17045447.pdf?src-supplier=Future+Electronics; ComponentLink7Description: https://datasheet.ciiva.com/17045/dcrcwe3-17045447.pdf?src-supplier=Future+Electronics; ComponentLink8URL: https://datasheet.ciiva.com/3257/dcrcwe3-3257468.pdf?src-supplier=Avnet; ComponentLink8Description: https://datasheet.ciiva.com/3257/dcrcwe3-3257468.pdf?src-supplier=Avnet; ComponentLink9URL: https://datasheet.ciiva.com/2525/dcrcwe3-2525245.pdf?src-supplier=Digi-Key; ComponentLink9Description: https://datasheet.ciiva.com/2525/dcrcwe3-2525245.pdf?src-supplier=Digi-Key; ComponentLink10URL: https://datasheet.ciiva.com/2525/dcrcwe3-2525246.pdf?src-supplier=Digi-Key; ComponentLink10Description: https://datasheet.ciiva.com/2525/dcrcwe3-2525246.pdf?src-supplier=Digi-Key; ComponentLink11URL: https://datasheet.ciiva.com/26314/fld-crcw-e3-data-en-26314670.pdf?src-supplier=Distrelec; ComponentLink11Description: https://datasheet.ciiva.com/26314/fld-crcw-e3-data-en-26314670.pdf?src-supplier=Distrelec; Price: 0.0093
REG1 REG2 = TS78L05CXRFG: TAIWAN SEMICONDUCTOR - TS78L05CX RFG - REG 3-TERMINAL 100MA, SMD, SOT23-3; Min Input Voltage: 0uV; Max Input Voltage: 35V; Number of Outputs: 1; Nominal Output Voltage: 5V; Supplier 1: Farnell; Supplier Part Number 1: 1476698; Manufacturer: Taiwan Semiconductor; Manufacturer Part Number: TS78L05CXRFG; Stock: 0; Pricing: 5=0.101, 50=0.099, 100=0.097, 250=0.0949, 500=0.0929, 1000=0.0909, 5000=0.0889, 10000=0.0869 (EUR); RoHS: Yes; Case/Package: SOT-23; Number of Pins: 3; Min Operating Temperature: 0°C; Max Operating Temperature: 125°C; Output Current: 100mA; Packaging: Cut Tape; REACH SVHC: No SVHC; ComponentLink1URL: http://www.farnell.com/datasheets/2044138.pdf?src-supplier=Farnell; ComponentLink1Description: http://www.farnell.com/datasheets/2044138.pdf?src-supplier=Farnell; ComponentLink2URL: http://www.farnell.com/datasheets/4546.pdf?src-supplier=Element14; ComponentLink2Description: http://www.farnell.com/datasheets/4546.pdf?src-supplier=Element14; ComponentLink3URL: http://www.taiwansemi.com/products/datasheet/TS78L00_I15.pdf?src-supplier=Digi-Key; ComponentLink3Description: http://www.taiwansemi.com/products/datasheet/TS78L00_I15.pdf?src-supplier=Digi-Key; Price: 0.262
U1 = ATTINY85-20SU: IC, 8BIT MCU, AVR TINY, 20MHZ, 8-SOIC; Manufacturer: Microchip / Atmel; Memory Type: FLASH; Memory Size: 8KB; Number of Timers/Counters: 2; RAM Size: 512B; Interface: SPI; Max Supply Voltage: 5.5V; Min Supply Voltage: 2.7V; Number of I/Os: 6; Oscillator Type: Internal; Peripherals: Brown-out Detect/Reset; Data Bus Width: 8b; Watchdog Timer: Yes; Number of ADC Channels: 4; Number of UART Channels: 1; Access Time: 20us; Supplier 1: Farnell; Supplier Part Number 1: 1455164; Manufacturer Part Number: ATTINY85-20SU; Stock: 2172; Pricing: 1=0.972, 25=0.925, 100=0.894, 1000=0.862 (EUR); RoHS: Yes; Mount: Surface Mount; Case/Package: SOIC; Number of Pins: 8; Contact Plating: Tin; Min Operating Temperature: -40°C; Max Operating Temperature: 85°C; Frequency: 20MHz; Packaging: Rail/Tube; Core Architecture: AVR; Package Quantity: 95; Number of Programmable I/O: 6; Max Frequency: 20MHz; Number of PWM Channels: 6; Density: 8KB; Number of SPI Channels: 1; Number of I2C Channels: 1; Termination: SMD/SMT; Length: 5.35mm; Height: 1.91mm; Width: 5.4mm; Radiation Hardening: No; Lead Free: Lead Free; REACH SVHC: No SVHC; ComponentLink1URL: https://datasheet.ciiva.com/1167/1698186-1167152.pdf?src-supplier=Newark; ComponentLink1Description: https://datasheet.ciiva.com/1167/1698186-1167152.pdf?src-supplier=Newark; ComponentLink2URL: https://datasheet.ciiva.com/15122/getdatasheetpartid-131914-15122511.pdf?src-supplier=Verical; ComponentLink2Description: https://datasheet.ciiva.com/15122/getdatasheetpartid-131914-15122511.pdf?src-supplier=Verical; ComponentLink3URL: https://datasheet.ciiva.com/26207/doc2586-26207573.pdf?src-supplier=Avnet+Europe; ComponentLink3Description: https://datasheet.ciiva.com/26207/doc2586-26207573.pdf?src-supplier=Avnet+Europe; ComponentLink4URL: https://datasheet.ciiva.com/28653/1698186-28653829.pdf?src-supplier=Element14; ComponentLink4Description: https://datasheet.ciiva.com/28653/1698186-28653829.pdf?src-supplier=Element14; ComponentLink5URL: https://datasheet.ciiva.com/3203/doc2586-3203150.pdf?src-supplier=Avnet; ComponentLink5Description: https://datasheet.ciiva.com/3203/doc2586-3203150.pdf?src-supplier=Avnet; Price: 0.98
VOL = POT_100kA_ALPHA_16mm: 100k Log potentiometer round shaft; Price: 0.5; Dimensions: 16mm; Package: PCB Mounted

### Notes on the sheet
- (in symbol TS78L05CXRFG) I; O; G